# Altium schematic sheet STM32.SchDoc
size B; SheetNumber: 1; SheetTotal: 1
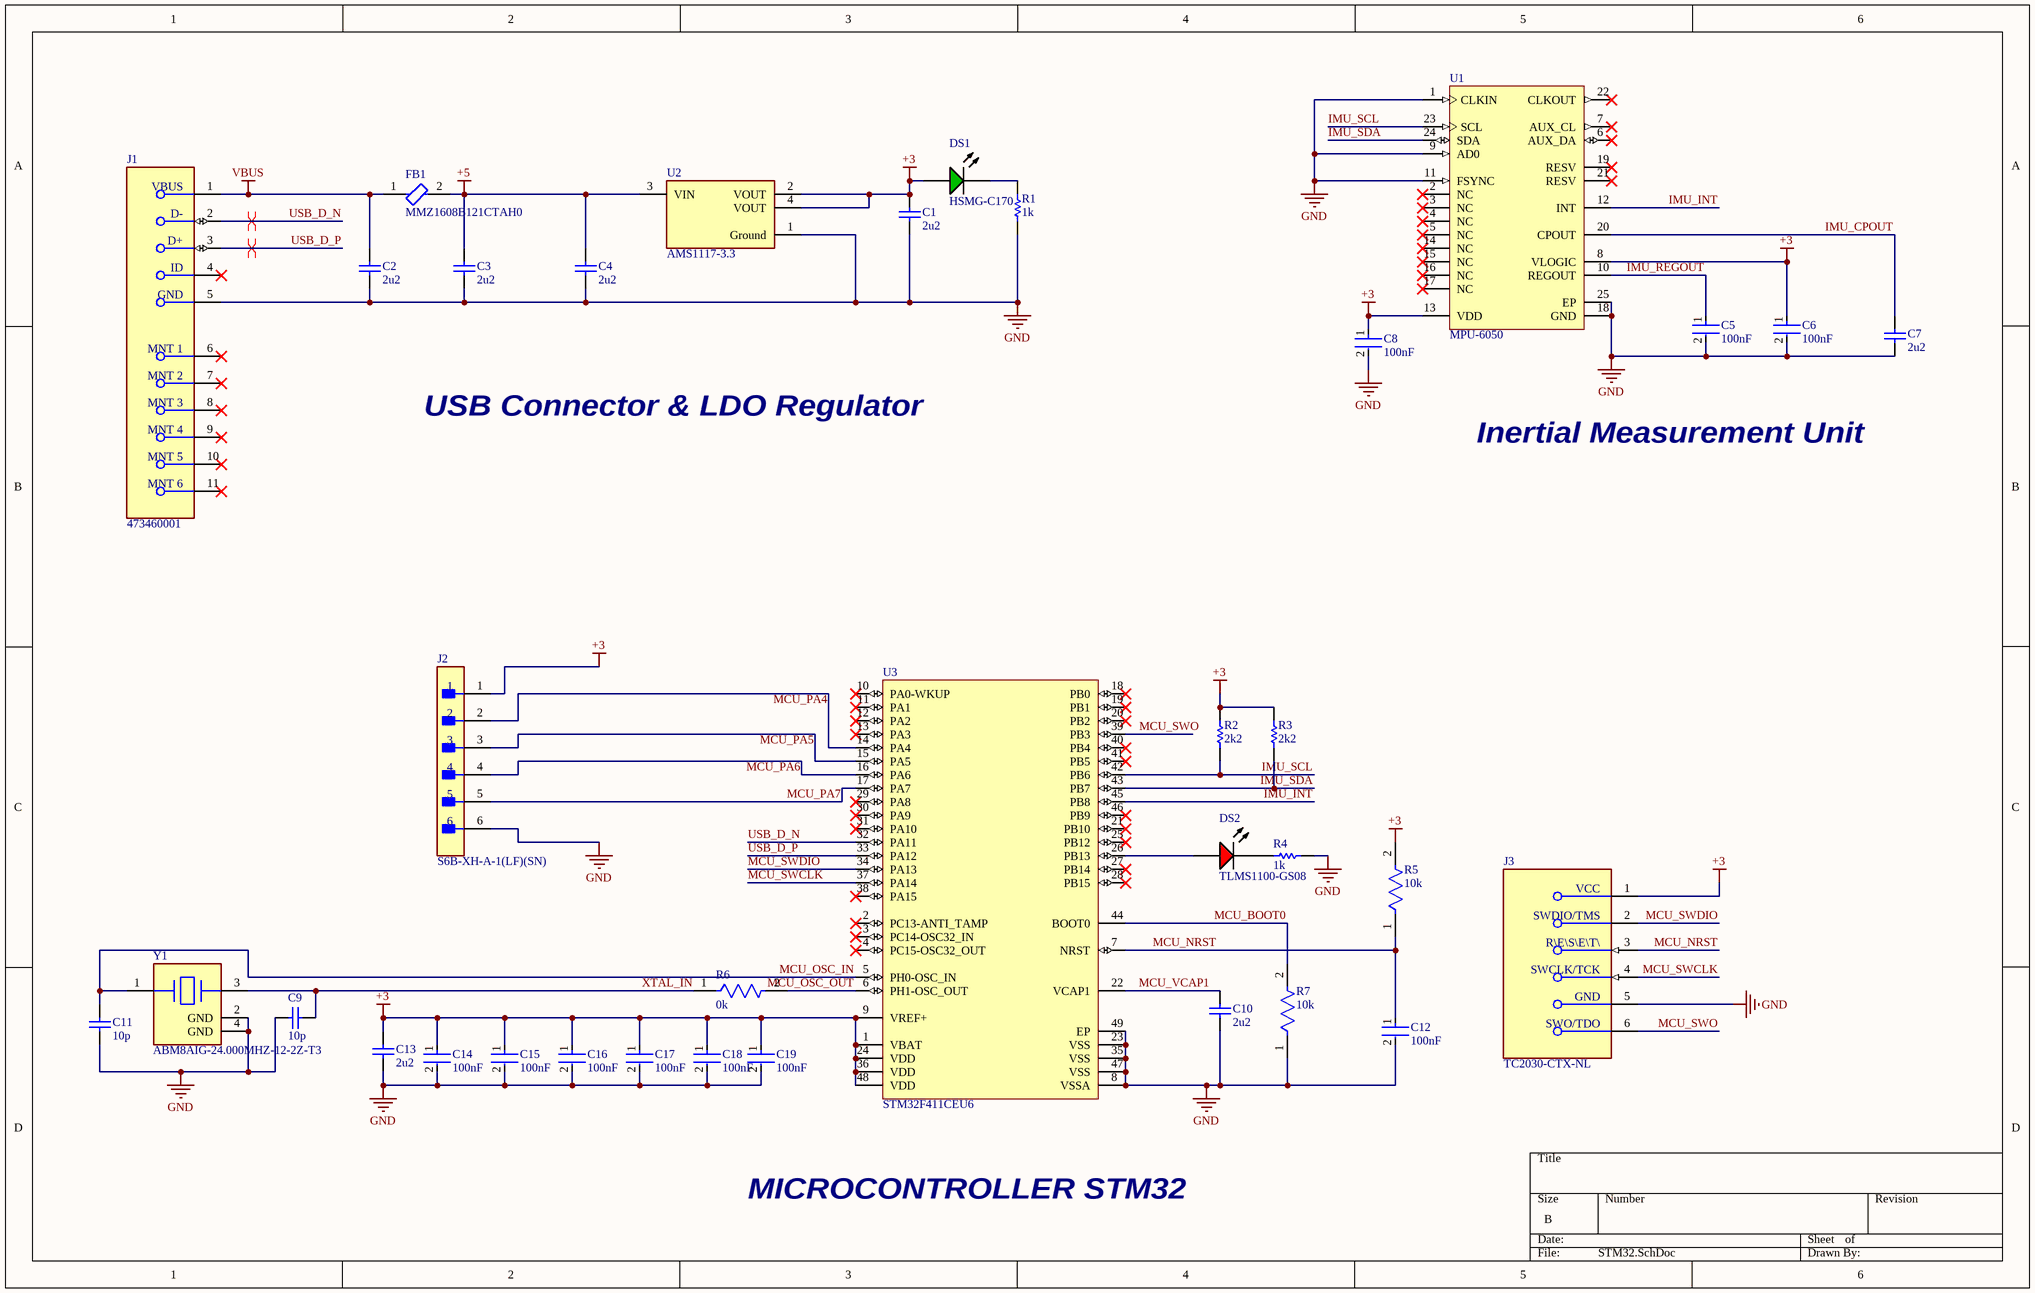
[diagram p0: STM32.SchDoc]

## Parts
C1  2u2  [CAPC2013X135X50ML10T20]
C2  2u2  [CAPC2013X135X50ML10T20]
C3  2u2  [CAPC2013X135X50ML10T20]
C4  2u2  [CAPC2013X135X50ML10T20]
C5  100nF  [FP-C0603C-CF-MFG]
C6  100nF  [FP-C0603C-CF-MFG]
C7  2u2  [CAPC2013X135X50ML10T20]
C8  100nF  [FP-C0603C-CF-MFG]
C9  10p  [CAPC1006X50X20ML10T10]
C10  2u2  [CAPC2013X135X50ML10T20]
C11  10p  [CAPC1006X50X20ML10T10]
C12  100nF  [FP-C0603C-CF-MFG]
C13  2u2  [CAPC2013X135X50ML10T20]
C14  100nF  [FP-C0603C-CF-MFG]
C15  100nF  [FP-C0603C-CF-MFG]
C16  100nF  [FP-C0603C-CF-MFG]
C17  100nF  [FP-C0603C-CF-MFG]
C18  100nF  [FP-C0603C-CF-MFG]
C19  100nF  [FP-C0603C-CF-MFG]
DS1  HSMG-C170  [AVAG-HSMX-C170_V]
DS2  TLMS1100-GS08  [VISH-TLMX1100_V]
FB1  MMZ1608B121CTAH0  [FP-MMZ1608-0_6-MFG]
J1  473460001  [FP-473460001-MFG]
J2  S6B-XH-A-1(LF)(SN)  [FP-S6B-XH-A-1_LF_SN-MFG]
J3  TC2030-CTX-NL  [FP-TC2030-CTX-NL-MFG]
R1  1k  [RESC2013X60X35ML10T20]
R2  2k2  [RESC1609X50X30ML10T20]
R3  2k2  [RESC1609X50X30ML10T20]
R4  1k  [RESC2013X60X35ML10T20]
R5  10k  [FP-CRCW0402-e3-IPC_B]
R6  0k  [FP-CRCW0402-e3-IPC_C]
R7  10k  [FP-CRCW0402-e3-IPC_B]
U1  MPU-6050  [IS-QFN-24_V]
U2  AMS1117-3.3  [FP-AMS1117-IPC_C]
U3  STM32F411CEU6  [STM-UFQFPN48_L]
Y1  ABM8AIG-24.000MHZ-12-2Z-T3  [FP-ABM8AIG-MFG]

## Nets
+3: C1.2 C6.1 C8.1 C13.2 C14.1 C15.1 C16.1 C17.1 C18.1 C19.1 DS1.1(A) J2.1 J3.1(VCC) R2.2 R3.2 R5.2 U1.8(VLOGIC) U1.13(VDD) U2.2(VOUT) U2.4(VOUT) U3.1(VBAT) U3.9(VREF+) U3.24(VDD) U3.36(VDD) U3.48(VDD)
+5: C3.2 C4.2 FB1.2 U2.3(VIN)
GND: C1.1 C2.1 C3.1 C4.1 C5.2 C6.2 C7.1 C8.2 C9.1 C10.1 C11.1 C12.2 C13.1 C14.2 C15.2 C16.2 C17.2 C18.2 C19.2 J1.5(GND) J2.6 J3.5(GND) R1.1 R4.2 R7.1 U1.1(CLKIN) U1.9(AD0) U1.11(FSYNC) U1.18(GND) U1.25(EP) U2.1(Ground) U3.8(VSSA) U3.23(VSS) U3.35(VSS) U3.47(VSS) U3.49(EP) Y1.2(GND) Y1.4(GND)
VBUS: C2.2 FB1.1 J1.1(VBUS)
IMU_CPOUT: C7.2 U1.20(CPOUT)
IMU_INT: U1.12(INT) U3.45(PB8)
IMU_REGOUT: C5.1 U1.10(REGOUT)
IMU_SCL: R2.1 U1.23(SCL) U3.42(PB6)
IMU_SDA: R3.1 U1.24(SDA) U3.43(PB7)
MCU_BOOT0: R7.2 U3.44(BOOT0)
MCU_NRST: C12.1 J3.3(~{RESET}) R5.1 U3.7(NRST)
MCU_OSC_IN: C11.2 U3.5(PH0-OSC_IN) Y1.1
MCU_OSC_OUT: R6.2 U3.6(PH1-OSC_OUT)
MCU_PA4: J2.2 U3.14(PA4)
MCU_PA5: J2.3 U3.15(PA5)
MCU_PA6: J2.4 U3.16(PA6)
MCU_PA7: J2.5 U3.17(PA7)
MCU_SWCLK: J3.4(SWCLK/TCK) U3.37(PA14)
MCU_SWDIO: J3.2(SWDIO/TMS) U3.34(PA13)
MCU_SWO: J3.6(SWO/TDO) U3.39(PB3)
MCU_VCAP1: C10.2 U3.22(VCAP1)
USB_D_N: J1.2(D-) U3.32(PA11)
USB_D_P: J1.3(D+) U3.33(PA12)
XTAL_IN: C9.2 R6.1 Y1.3
NetDS1_2: DS1.2(K) R1.2
NetDS2_1: DS2.1(A) U3.26(PB13)
NetDS2_2: DS2.2(K) R4.1

Not connected (* = marked no-connect by the designer): J1 4(ID)* 6(MNT_1)* 7(MNT_2)* 8(MNT_3)* 9(MNT_4)* 10(MNT_5)* 11(MNT_6)*; U1 2(NC)* 3(NC)* 4(NC)* 5(NC)* 6(AUX_DA)* 7(AUX_CL)* 14(NC)* 15(NC)* 16(NC)* 17(NC)* 19(RESV)* 21(RESV)* 22(CLKOUT)*; U3 2(PC13-ANTI_TAMP)* 3(PC14-OSC32_IN)* 4(PC15-OSC32_OUT)* 10(PA0-WKUP)* 11(PA1)* 12(PA2)* 13(PA3)* 18(PB0)* 19(PB1)* 20(PB2)* 21(PB10)* 25(PB12)* 27(PB14)* 28(PB15)* 29(PA8)* 30(PA9)* 31(PA10)* 38(PA15)* 40(PB4)* 41(PB5)* 46(PB9)*

## Layout directives
differential pair; differential pair class DIFF_USB: USB_D_N, USB_D_P

## Notes on the sheet
- USB Connector & LDO Regulator
- Inertial Measurement Unit
- MICROCONTROLLER STM32

## Library data of the parts
C1-C4 C7 C10 C13 = CMP-2007-03455-1: Manufacturer: Murata; Part Number: GRM21BR71C225KA12L
C5 C6 C8 C12 C14-C19 = CMP-2006-03811-3: Capacitor; Ceramic; Cap; .100uF; Tol 10%; SMT; Vol-Rtg 16V; X7R; Tape and Reel; Manufacturer Part Number: C0603C104K4RACTU; Manufacturer: KEMET; Value: 0.10 μF; Temperature Coefficient: 30ppm/°C; Automotive Grade: Grade 1; Tolerance: 0.1; Digikey Description: Capacitor; Ceramic; Cap; .100uF; Tol 10%; SMT; Vol-Rtg 16V; X7R; Tape and Reel; Automotive: Yes; Temperature Range High: +125°C; Device Class L1: Passive Components; Material: Ceramic; Lead Free: Yes; Device Class L2: Capacitors; Capacitance: 0.10 μF; Height: 0.87mm; Voltage Rating: 16 V; Octopart: https://octopart.com/c0603c104k4ractu-kemet-93067; Package: C0603C-CF; Temperature Characteristic: X7R; Device Class L3: Ceramic Capacitors; ComponentLink2URL: https://api.kemet.com/component-edge/download/datasheet/C0603C100J5GACAUTO.pdf; Temperature Range Low: -55°C; ComponentLink2Description: Datasheet; Mouser Description: Multilayer Ceramic Capacitors MLCC - SMD/SMT 16volts 0.1uF 10% X7R 10%; RoHS: TRUE; Temperature: -55°C to +125°C; Category: Cap
C9 C11 = CMP-2008-04829-1: Manufacturer: AVX Interconnect / Elco; Part Number: 0402YJ100FBSTR
DS1 = CMP-2000-05062-1: Chip LED, Green, 2.2 V, -40 to 85 degC, 2-Pin SMD, Pb-Free, Tape and Reel; Manufacturer: Avago; No. of Pins: 2; Peak Wavelength: 570nm; SVHC: NoSVHC(16-Jun-2014); Dominant Wavelength: 572nm; Forward Current If: 20mA; Viewing Angle: 170deg; Lens Shape: Rectangular; PIV Max: 5V; External Width: 1.25mm; LED Type: Standard; External Depth: 0.8mm; Opto Mounting Orientation: Top; Luminous Intensity: 15mcd; Luminous Intensity Min: 4mcd; Forward Voltage VF Max: 2.6V; External Length / Height: 2mm; Bulb Size: 1.25mmx1.4mm; Light Area Height: 1mm; Voltage Vf Typ: 2.2V; Operating Temperature Max: 85degC; Datasheet Version: Oct-08; MSL: MSL2A-4weeks; Peak Forward Current: 20mA; Package Description: 2-Pin Surface Mount Device, Body 2 x 1.25 mm, Height 0.8 mm; Datasheet URL: https://datasheet.ciiva.com/29280/180495-da-01-en-chip-led-hsmg-c170-gelb-gruen-29280971.pdf; Storage Temperature Min: -40degC; LED Colour: Green; Wavelength Typ: 570nm; Mounting Type: SMD; Forward Current If Max: 20mA; Dominant Wavelength Typ: 572nm; LED Mounting: SMD; Operating Temperature Range: -30degCto+85degC; Operating Temperature Min: -30degC; Manufacturer URL: http://www.avagotech.com/; Packaging: CutTape; Luminous Intensity Typ: 15mcd; Package Reference: HSMX-C170; Storage Temperature Max: 85degC; Opto Case Style: SMD; Forward Voltage: 2.2V
DS2 = CMP-1666-00027-1: LED, RED, 2.1 V, -40 to 100 degC, 2-Pin SMD (0603), RoHS, Tape and Reel; Type (Capacitors): C0G; Resistance: 100000000000 Ohm; Capacitance: 12 pF; Voltage Rating: 50 V; Tolerance: 5%; Min Operating Temperature: -55degC; REACH SVHC: No SVHC; ComponentLink2Description: Datasheet; ComponentLink1URL: http://www.vishay.com/; Width: 0.8 mm; Package Quantity: 4000; PackageReference: TLMX1100; ComponentLink2URL: http://www.vishay.com/docs/83173/tlmb1100.pdf; Case/Package: 0603; Case Code (Metric): 1608; Packaging: Tape and Reel; Pins: 2; ComponentLink1Description: Manufacturer URL; Max Operating Temperature: 125degC; Height: 0.8 mm; Length: 1.6 mm; Mount: Surface Mount; PackageDescription: 2-Pin Surface Mount Device, Body 1.6 x 0.8 mm; DatasheetVersion: Rev. 2.7, 03/2016; Case Code (Imperial): 0603; Voltage Rating (DC): 50 V; RoHSCompliant: True; Radiation Hardening: No
FB1 = CMP-08257-000037-1: FERRITE BEAD 120 OHM 0603 1LN; Tolerance: 25%; DC Resistance (DCR): 150mR; Max DC Current: 600mA; Impedance: 120R; Package Quantity: 4000; Case Code (Imperial): 0603; Width: 0.031inch; REACH SVHC: No SVHC; Depth: 0.8mm; Core Material: Ferrite; Packaging: Cut Tape; Case/Package: 0603; Length: 0.063inch; RoHS Compliant: Yes; Case Code (Metric): 1608; Height: 0.03inch; Mount: Surface Mount; Current Rating: 600mA
J1 = CMP-2000-05246-2: CONN RCPT USB2.0 MICRO B SMD R/A; Manufacturer: Molex; Conn Orientation: Right Angle; Is Female: yes; Shielding: true; Pitch: 0.65mm; Number Of Contacts: 5; Voltage Rating: 30V; Current Rating: 1.8A; Device Class L2: USB Connectors; Digikey Description: CONN RCPT USB2.0 MICRO B SMD R/A; Height: 2.945mm; RoHS: TRUE; ComponentLink2Description: Datasheet; Octopart: https://octopart.com/47346-0001-molex-7164928; Automotive: No; Package: 0; Category: Conn; Device Class L1: Connectors; Usb Standard: USB 2.0; Temperature: -30°C to +85°C; Temperature Range Low: -30°C; Footprint Url: https://www.molex.com/pdm_docs/sd/473460001_sd.pdf; ComponentLink2URL: https://www.molex.com/webdocs/datasheets/pdf/en-us/0473460001_IO_CONNECTORS.pdf; Lead Free: Yes; Manufacturer Part Number: 473460001; Contact Material: Gold,Nickel; Temperature Range High: +85°C; Device Class L3: unset
J2 = CMP-17439-000023-1: CONN HEADER R/A P6OS 2.5MM; Voltage Rating: 250V; Insulation Resistance: 1GR; Current Rating: 3A; Number of Positions: 6; Gender: Male; Mount: Through Hole; Material: Polyamide; Max Operating Temperature: 85°C; Contact Plating: Tin; Number of Rows: 1; Color: Natural; Termination: Crimp; Min Operating Temperature: -25°C; Pitch: 2.5mm; Lead Free: Lead Free; Contact Material: Brass
J3 = CMP-205963-000001-1: 6-Pin “No legs” TC2030 Plug-of-Nails™ Cable for use with ARM Cortex processors
R1 R4 = CMP-2100-03671-1: Chip Resistor, 1 KOhm, +/- 1%, 125 mW, -55 to 155 degC, 0805 (2012 Metric), RoHS, Tape and Reel; Manufacturer: Yageo; Temperature Coefficient: 100ppm/degreesC; Voltage Rating (DC): 150V; Max Power Dissipation: 125mW; Resistance: 1KOhm; Number of Pins: 2; Number of Terminations: 2; Datasheet URL: http://www.yageo.com/NewPortal/yageodocoutput?fileName=/pdf/R-Chip/PYu-RC_Group_51_RoHS_L_5.pdf; Length: 0.079inch; Package Description: 2-Pin Surface Mounted Device, Body 2 x 1.25 mm; Depth: 1.25mm; Height: 0.024inch; Military Standard: Not; Case/Package: 0805; Package Reference: 0805; RoHSCompliant: true; Lead Free: LeadFree; Packaging: TapeandReel; Package Quantity: 1; Datasheet Version: Rev. 5, 10/2016; Tolerance: 1%; Min Operating Temperature: -55degC; Voltage Rating: 150V; Composition: ThickFilm; Case Code (Imperial): 0805; Power Rating: 125mW; Width: 0.049inch; Case Code (Metric): 2012; Manufacturer URL: http://www.yageo.com/; Max Operating Temperature: 155degC; REACH SVHC: Unknown; Termination: SMD/SMT
R2 R3 = CMP-2000-03206-1: Manufacturer: Vishay Dale; Part Number: CRCW06032R20FKEA
R5 R7 = CMP-2002-08135-2: RES SMD 10K OHM 1% 1/16W 0402; Power Rating: 63mW; Resistance: 10kR; Voltage Rating: 50V; Temperature Coefficient: 100ppm/°C; Case Code (Metric): 1005; Features: Automotive AEC-Q200; Termination: SMD/SMT; Mount: Surface Mount; Package Quantity: 10; Packaging: Tape and Reel; Case Code (Imperial): 0402; Weight: 2.3E-05oz; Lead Free: Lead Free; Width: 0.02inch; Max Power Dissipation: 63mW; Tolerance: 1%; Number of Terminations: 2; Height: 0.35mm; Number of Pins: 2; Composition: Thick Film; Length: 1mm; Voltage Rating (DC): 50V; Case/Package: 0402; Radiation Hardening: No; Contact Plating: Tin; Depth: 0.5mm; Military Standard: Not; Min Operating Temperature: -55°C; Max Operating Temperature: 155°C
R6 = CMP-2002-08122-2: RES Thick Film, 0Ω, 0.063W, 0402; Tolerance: 5%; Max Power Dissipation: 63mW; Voltage Rating: 50V; Temperature Coefficient: 100ppm/°C; Resistance: 0mR; Contact Plating: Tin; Height: 0.35mm; Radiation Hardening: No; Features: Automotive AEC-Q200; Composition: Thick Film; Width: 0.5mm; Weight: 2.3E-05oz; Termination: SMD/SMT; Packaging: Tape and Reel; Mount: Surface Mount; Case Code (Metric): 1005; Military Standard: Not; Min Operating Temperature: -55°C; Number of Terminations: 2; Package Quantity: 1; Case Code (Imperial): 0402; Depth: 0.5mm; Max Operating Temperature: 155°C; Case/Package: 0402; Power Rating: 63mW; Lead Free: Lead Free; Voltage Rating (DC): 50V; Length: 1mm
U1 = CMP-1753-00002-2: 3-Axis Gyroscope, Accelerometer and a Digital Motion Processor(TM) (DMP), 2.375 to 3.46 V, -40 to 85 degC, 24-Pin QFN, RoHS, Tape and Reel; Manufacturer: InvenSense; Featured Product: MPU-60506-Axis,IntegratedI²CSolution; Other Names: 1428-1007-2 / MPU6050; Sensor Type: MotionTracking; Online Catalog: MPU-6000™Series; Unit PriceUSD: Digital; Datasheet Version: Rev. 3.3, 05/2012; Category: Sensors,Transducers; Datasheet URL: http://datasheet.octopart.com/MPU-6050-InvenSense-datasheet-14421344.pdf; Family: Multifunction; Standard Package: 5,000; Manufacturer URL: http://www.invensense.com/; Output Type: Digital; Dynamic Catalog: MPU-6000™Series
U2 = CMP-209535-000001-1: LDO Voltage Regulators 1A, 3.3V; Manufacturer: Advanced Monolithic Systems; Dropout Voltage: 1.1V; Output Type: Fixed; Nominal Supply Current: 5mA; Max Power Dissipation: 1.2W; Max Supply Voltage: 15V; Number Of Outputs: 1; Standoff Height: 0.64mm; Max Junction Temp: +125°C; Height: 1.8mm; Package: AMS1117; Device Class L2: Power Management ICs; ComponentLink2Description: Datasheet; ComponentLink2URL: http://www.advanced-monolithic.com/pdf/ds1117.pdf; Category: IC; RoHS: TRUE; Automotive: No; Device Class L1: Integrated Circuits (ICs); Output Current: 1A; Device Class L3: Voltage Regulators - Linear; Temperature: -40°C to +125°C; Output Voltage: 3.3V; Manufacturer Part Number: AMS1117-3.3; Temperature Range Low: -40°C; Octopart: https://octopart.com/ams1117-3.3-advanced+monolithic+systems-25899300; Lead Free: Yes; Ipc Land Pattern Name: SOT229P700X180-4; Temperature Range High: +125°C
U3 = CMP-0243-00165-1: ARM Cortex-M4 32-bit MCU+FPU, 512 KB Flash, 128 KB RAM, 36 I/Os, 48-Pin UFQFPN, -40 to 85 degC, Tray; Operating Frequency(F) (Processor speed) (MHz): 100; FLASH Size (Prog) (kB): 512; Internal RAM Size (kB): 128; I/Os (High Current): 36; Supply Voltage(Vcc) min (V): 1.7; Package Reference: 48-Pin Ultra Thin Fine Pitch Quad Flat No-Lead, 7 x 7 x 0.6 mm Body, 0.5 mm Pitch, Exposed Pad; ComponentLink1Description: Manufacturer URL; ComponentLink1URL: http://www.st.com/; Packing: Tray; Package Description: UFQFPN48; Core: ARM Cortex-M4; ComponentLink2Description: Datasheet; ComponentLink2URL: http://www.st.com/st-web-ui/static/active/en/resource/technical/document/datasheet/DM00115249.pdf; DatasheetVersion: Rev. 6; Mounting Technology: Surface Mount
Y1 = CMP-27762-015716-1: Crystal 24MHz ±20ppm (Tol) ±50ppm (Stability) 12pF FUND 50Ω Automotive 4-Pin Ultra Mini-CSMD T/R; ESR (Equivalent Series Resistance): 50R; Series: ABM8AIG; RoHS Compliant: Yes; Load Capacitance: 12pF; Height: 0.031inch; Min Operating Temperature: -40°C; Mount: Surface Mount; Packaging: Cut Tape; Ratings: AEC-Q200; Case/Package: SMD/SMT; Frequency Stability: 50ppm; Max Operating Temperature: 125°C; Length: 0.126inch; Frequency: 24MHz; Frequency Tolerance: 20ppm; Width: 0.098inch